# Altium schematic sheet Tenk.SchDoc: T90MProboj
size A3; Date: 2.2.2023; Author: Petar Ubavic; DrawnBy: Petar Ubavic; Engineer: Petar Ubavic; Organization: Ekipa 9; DocumentNumber: 1.1; SheetNumber: 1; SheetTotal: 1; CurrentTime: 15:06; CurrentDate: 2.2.2023; DocumentFullPathAndName: Tenk.SchDoc; DocumentName: Tenk; ProjectName: T90MProboj; Rule: PcbType=ProtelPcb; Rule: PcbType=ProtelPcb; Rule: PcbType=ProtelPcb
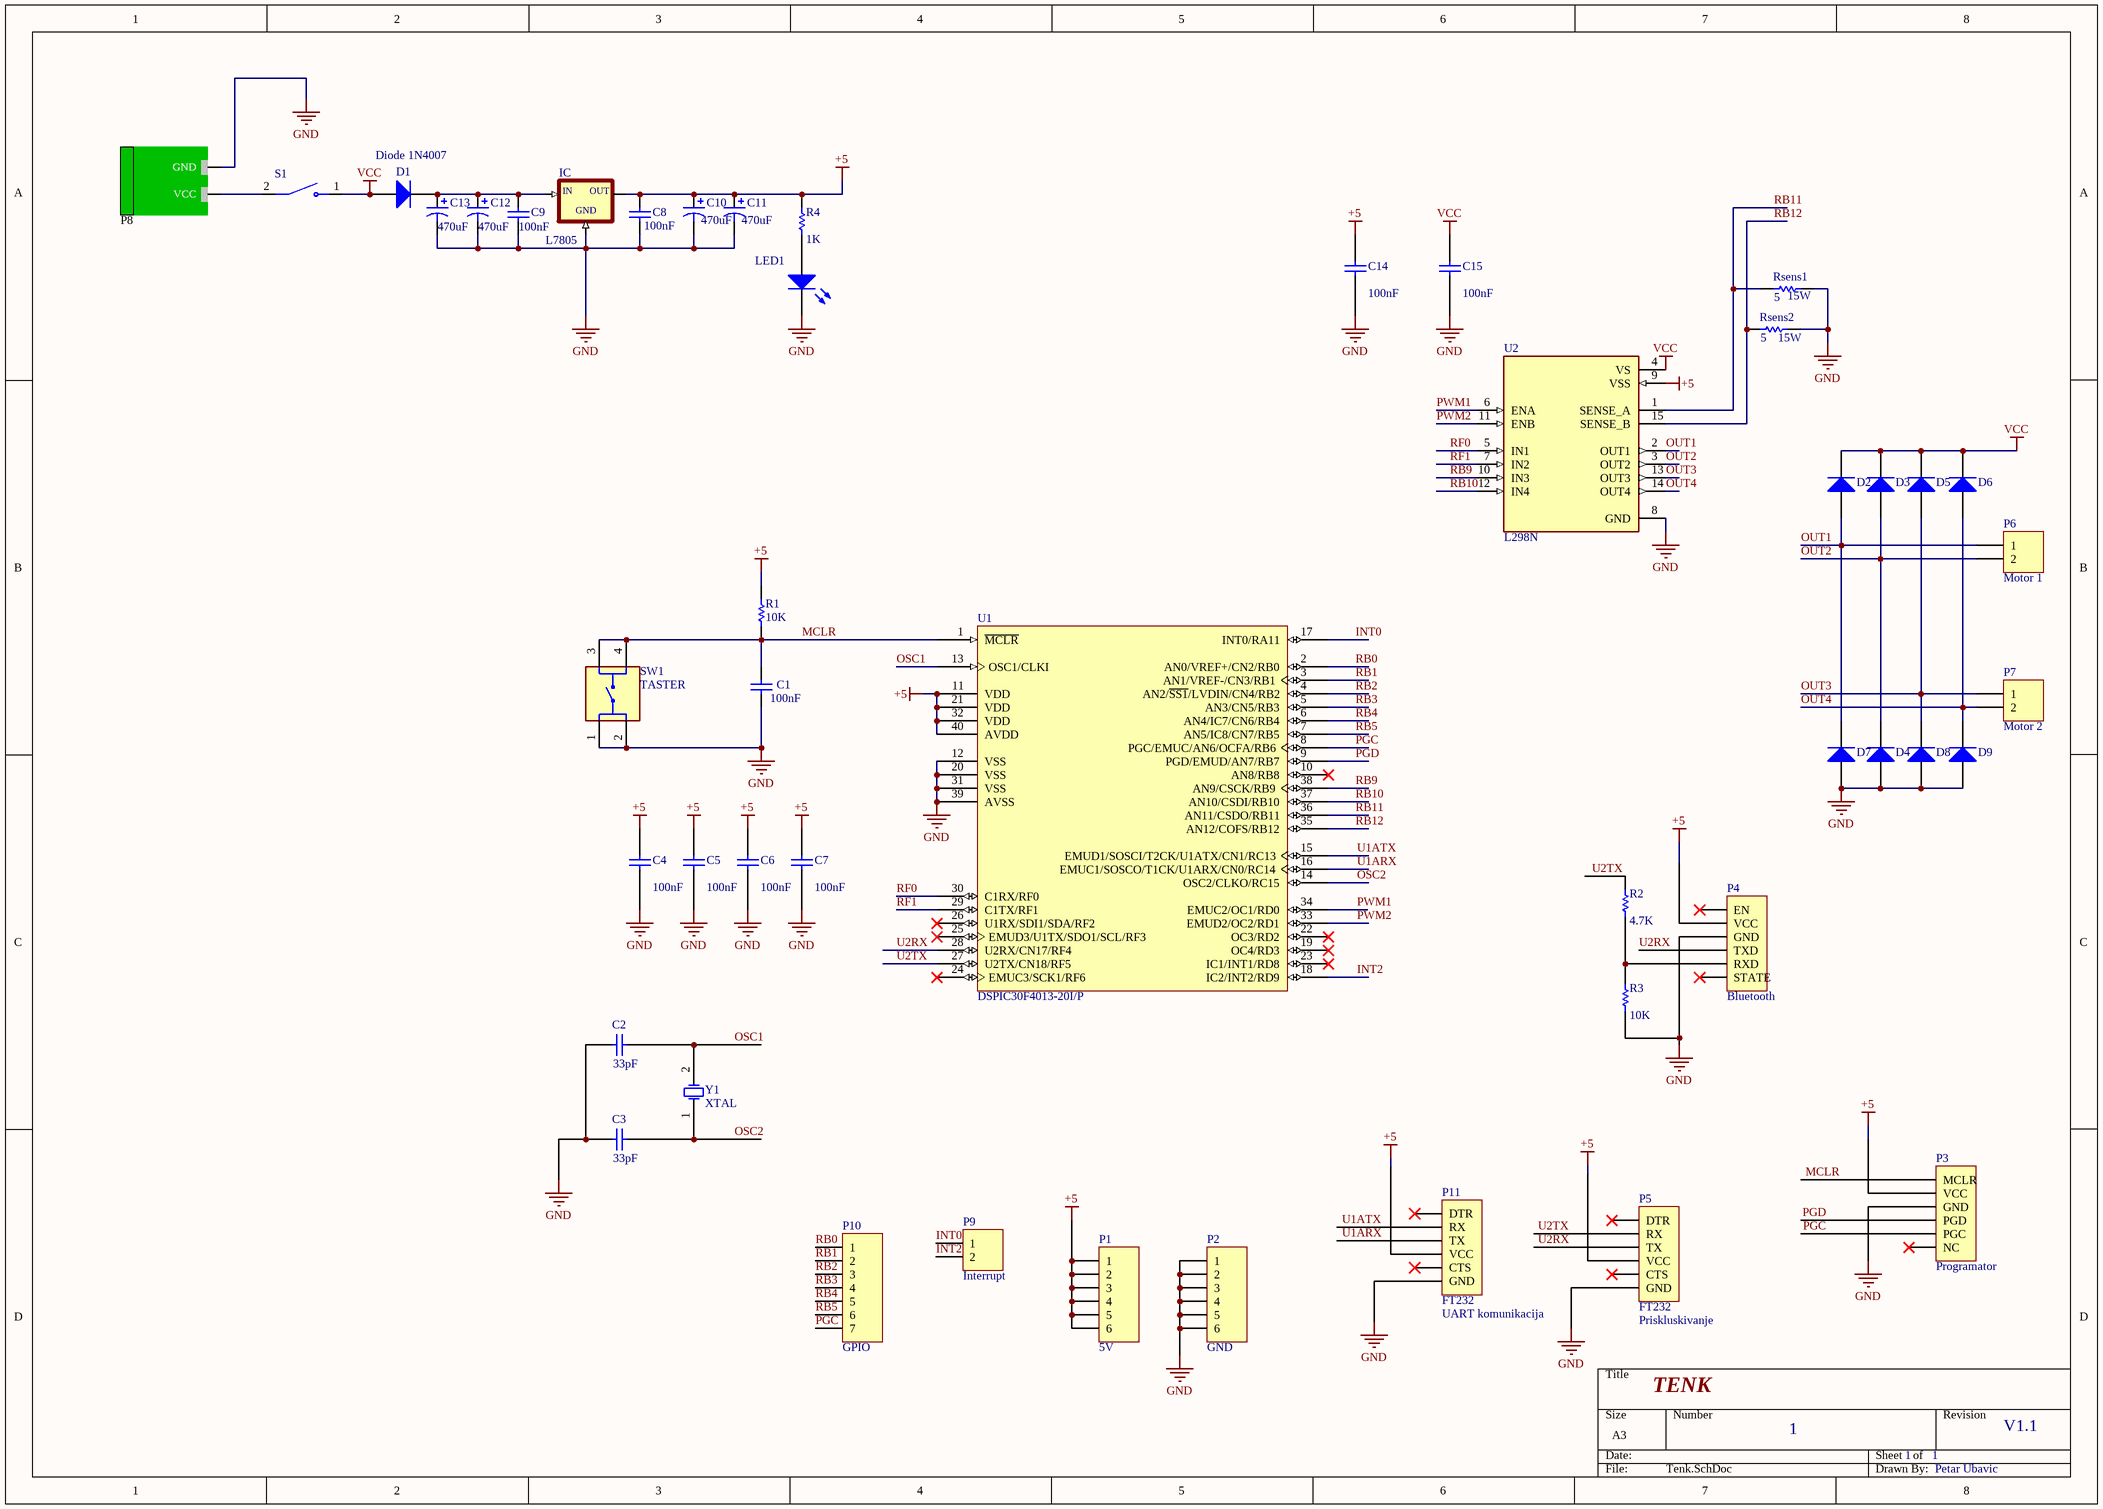
[diagram p0: Tenk.SchDoc]

## Parts
C1  value 100nF  [CAP200]  (hidden comment: Cap)
C2  value 33pF  [CAP200]  (hidden comment: Cap)
C3  value 33pF  [CAP200]  (hidden comment: Cap)
C4  value 100nF  [CAP200]  (hidden comment: Cap)
C5  value 100nF  [CAP200]  (hidden comment: Cap)
C6  value 100nF  [CAP200]  (hidden comment: Cap)
C7  value 100nF  [CAP200]  (hidden comment: Cap)
C8  value 100nF  [CAP200]  (hidden comment: Cap)
C9  value 100nF  [CAP200]  (hidden comment: Cap)
C10  value 470uF  [RAD4]  (hidden comment: Cap Pol1)
C11  value 470uF  [RAD4]  (hidden comment: Cap Pol1)
C12  value 470uF  [RAD4]  (hidden comment: Cap Pol1)
C13  value 470uF  [RAD4]  (hidden comment: Cap Pol1)
C14  value 100nF  [CAP200]  (hidden comment: Cap)
C15  value 100nF  [CAP200]  (hidden comment: Cap)
D1  Diode 1N4007  [DIODE400]
D2  Diode 1N5402  [DIODE400]  (value not drawn)
D3  Diode 1N5402  [DIODE400]  (value not drawn)
D4  Diode 1N5402  [DIODE400]  (value not drawn)
D5  Diode 1N5402  [DIODE400]  (value not drawn)
D6  Diode 1N5402  [DIODE400]  (value not drawn)
D7  Diode 1N5402  [DIODE400]  (value not drawn)
D8  Diode 1N5402  [DIODE400]  (value not drawn)
D9  Diode 1N5402  [DIODE400]  (value not drawn)
IC  L7805  [78XXS]
LED1  GREEN  [LED_2]  (value not drawn)
P1  5V  [HEADER_6]
P2  GND  [HEADER_6]
P3  Programator  [HEADER_6]
P4  Bluetooth  [HEADER_6]
P5  FT232  [HEADER_6]
P6  Motor 1  [HDR1X2]
P7  Motor 2  [HDR1X2]
P8  2EDGRC-5.08-02P-14-00A(H)  [PWR_Con]  (value not drawn)
P9  Interrupt  [HDR1X2]
P10  GPIO  [HDR1X7]
P11  FT232  [HEADER_6]
R1  value 10K  [RES400]  (hidden comment: Res1)
R2  value 4.7K  [RES400]  (hidden comment: Res1)
R3  value 10K  [RES400]  (hidden comment: Res1)
R4  value 1K  [RES400]  (hidden comment: Res1)
Rsens1  15W  value 5  [Rsens]
Rsens2  15W  value 5  [Rsens]
S1  (no value)  [SW_RB141C1100]
SW1  TASTER  [SW_1825910-6-4]
U1  DSPIC30F4013-20I/P  [PDIP600-P40]
U2  L298N  [TO127P2020X500X2100-15]
Y1  XTAL  [OSC_5]

## Nets
+5: C4.2 C5.2 C6.2 C7.2 C8.2 C10.1 C11.1 C14.2 IC.OUT P1.1 P1.2 P1.3 P1.4 P1.5 P1.6 P3.2(VCC) P4.2(VCC) P5.4(VCC) P11.4(VCC) R1.2 R4.2 U1.11(VDD) U1.21(VDD) U1.32(VDD) U1.40(AVDD) U2.9(VSS)
GND: C1.1 C2.1 C3.1 C4.1 C5.1 C6.1 C7.1 C8.1 C9.1 C10.2 C11.2 C12.2 C13.2 C14.1 C15.1 D4.1(A) D7.1(A) D8.1(A) D9.1(A) IC.GND LED1.2(K) P2.1 P2.2 P2.3 P2.4 P2.5 P2.6 P3.3(GND) P4.3(GND) P5.6(GND) P8.1(GND) P11.6(GND) R3.1 Rsens1.2 Rsens2.2 SW1.1 SW1.2 U1.12(VSS) U1.20(VSS) U1.31(VSS) U1.39(AVSS) U2.8(GND)
VCC: C15.2 D1.1(A) D2.2(K) D3.2(K) D5.2(K) D6.2(K) S1.1 U2.4(VS)
INT0: P9.1 U1.17(INT0/RA11)
INT2: P9.2 U1.18(IC2/INT2/RD9)
MCLR: C1.2 P3.1(MCLR) R1.1 SW1.3 SW1.4 U1.1(~{MCLR})
OSC1: C2.2 U1.13(OSC1/CLKI) Y1.2(OSC2)
OSC2: C3.2 U1.14(OSC2/CLKO/RC15) Y1.1(OSC1)
OUT1: D2.1(A) D7.2(K) P6.1 U2.2(OUT1)
OUT2: D3.1(A) D4.2(K) P6.2 U2.3(OUT2)
OUT3: D5.1(A) D8.2(K) P7.1 U2.13(OUT3)
OUT4: D6.1(A) D9.2(K) P7.2 U2.14(OUT4)
PGC: P3.5(PGC) P10.7 U1.8(PGC/EMUC/AN6/OCFA/RB6)
PGD: P3.4(PGD) U1.9(PGD/EMUD/AN7/RB7)
PWM1: U1.34(EMUC2/OC1/RD0) U2.6(ENA)
PWM2: U1.33(EMUD2/OC2/RD1) U2.11(ENB)
RB0: P10.1 U1.2(AN0/VREF+/CN2/RB0)
RB1: P10.2 U1.3(AN1/VREF-/CN3/RB1)
RB2: P10.3 U1.4(AN2/~{SS1}/LVDIN/CN4/RB2)
RB3: P10.4 U1.5(AN3/CN5/RB3)
RB4: P10.5 U1.6(AN4/IC7/CN6/RB4)
RB5: P10.6 U1.7(AN5/IC8/CN7/RB5)
RB9: U1.38(AN9/CSCK/RB9) U2.10(IN3)
RB10: U1.37(AN10/CSDI/RB10) U2.12(IN4)
RB11: Rsens1.1 U1.36(AN11/CSDO/RB11) U2.1(SENSE_A)
RB12: Rsens2.1 U1.35(AN12/COFS/RB12) U2.15(SENSE_B)
RF0: U1.30(C1RX/RF0) U2.5(IN1)
RF1: U1.29(C1TX/RF1) U2.7(IN2)
U1ARX: P11.3(TX) U1.16(EMUC1/SOSCO/T1CK/U1ARX/CN0/RC14)
U1ATX: P11.2(RX) U1.15(EMUD1/SOSCI/T2CK/U1ATX/CN1/RC13)
U2RX: P4.4(TXD) P5.3(TX) U1.28(U2RX/CN17/RF4)
U2TX: P5.2(RX) R2.2 U1.27(U2TX/CN18/RF5)
NetC9_2: C9.2 C12.1 C13.1 D1.2(K) IC.IN
NetLED1_1: LED1.1(A) R4.1
NetP4_5: P4.5(RXD) R2.1 R3.2
NetP8_2: P8.2(VCC) S1.2

Not connected (* = marked no-connect by the designer): P3 6(NC)*; P4 1(EN)* 6(STATE)*; P5 1(DTR)* 5(CTS)*; P11 1(DTR)* 5(CTS)*; U1 10(AN8/RB8)* 19(OC4/RD3)* 22(OC3/RD2)* 23(IC1/INT1/RD8)* 24(EMUC3/SCK1/RF6)* 25(EMUD3/U1TX/SDO1/SCL/RF3)* 26(U1RX/SDI1/SDA/RF2)*

## Notes on the sheet
- (near P11) UART komunikacija
- (near P5) Priskluskivanje
- TENK
- 1
- V1.1
- Petar Ubavic

## Library data of the parts
C1-C9 C14 C15 = Cap: Capacitor; Published: 8-Jun-2000; LatestRevisionDate: 17-Jul-2002; LatestRevisionNote: Re-released for DXP Platform.; PackageReference: RAD-0.3; Publisher: Altium Limited; PackageDescription: Radial Cap, Thru-Hole; 2 Leads; 0.3 in Pin Spacing
C10-C13 = Cap Pol1: Polarized Capacitor (Radial); Published: 8-Jun-2000; LatestRevisionDate: 17-Jul-2002; LatestRevisionNote: Re-released for DXP Platform.; PackageReference: RB7.6-15; Publisher: Altium Limited; PackageDescription: Polarized Capacitor (Radial); 2 Leads
D1 = Diode 1N4007: 1 Amp General Purpose Rectifier; Published: 8-Jun-2000; LatestRevisionDate: 17-Jul-2002; LatestRevisionNote: Re-released for DXP Platform.; DatasheetVersion: 1998; PackageVersion: Aug-1999; PackageReference: DO-41; Publisher: Altium Limited; PackageDescription: Diode, Axial; Body 5.2 x 2.7 mm (LxDia. max), Lead Dia. 0.86 mm (max); Code_JEDEC: DO-204-AL; ComponentLink1Description: Manufacturer Link; ComponentLink1URL: http://www.fairchildsemi.com/; ComponentLink2Description: Datasheet; ComponentLink2URL: http://www.fairchildsemi.com/ds/1N%2F1N4001.pdf
D2-D9 = Diode 1N5402: 3 Amp General Purpose Rectifier; Published: 8-Jun-2000; LatestRevisionDate: 17-Jul-2002; LatestRevisionNote: Re-released for DXP Platform.; DatasheetVersion: 1998; PackageVersion: Aug-1999; PackageReference: DO-201AD; Publisher: Altium Limited; PackageDescription: Diode, Axial; Body 9.5 x 5.6 mm (LxDia. max), Lead Dia. 1.32 mm (max); ComponentLink1Description: Manufacturer Link; ComponentLink1URL: http://www.fairchildsemi.com/; ComponentLink2Description: Datasheet; ComponentLink2URL: http://www.fairchildsemi.com/ds/1N%2F1N5400.pdf
IC = L7805: Linear Voltage Regulator IC 1 Output 1.5A D2PAK; MF: STMicroelectronics; Package: TO-263-3 Inchange Semiconductor; Availability: Unavailable; MP: L7805; Value: *; SnapEDA_Link: https://www.snapeda.com/parts/L7805/STMicroelectronics/view-part/563125/?ref=snap; Price: None
LED1 = LED1: Typical RED GaAs LED; Published: 8-Jun-2000; LatestRevisionDate: 08-Jul-2005; LatestRevisionNote: Mech Layer 1 removed.; PackageReference: LED-1; Publisher: Altium Limited; PackageDescription: LED; 2 Leads
P1-P5 P11 = Header 6: Header, 6-Pin; LatestRevisionDate: 17-Jul-2002; LatestRevisionNote: Re-released for DXP Platform.; Publisher: Altium Limited
P6 P7 P9 = Header 2: Header, 2-Pin; LatestRevisionDate: 17-Jul-2002; LatestRevisionNote: Re-released for DXP Platform.; Publisher: Altium Limited
P8 = 00000002: TERM BLOCK HDR 2POS 90DEG 5.08MM; Suplier: TME; Manufacturer Part Number: 2EDGRC-5.08-02P-14-00A(H); Suplier Product Link: https://www.tme.eu/en/details/2edgrc5.08-2p14/pluggable-terminal-blocks/degson-electronics/2edgrc-508-02p-14-00ah/; Price: 0.1304
P10 = Header 7: Header, 7-Pin; LatestRevisionDate: 17-Jul-2002; LatestRevisionNote: Re-released for DXP Platform.; Publisher: Altium Limited
R1-R4 Rsens1 Rsens2 = Res1: Resistor; Published: 8-Jun-2000; LatestRevisionDate: 17-Jul-2002; LatestRevisionNote: Re-released for DXP Platform.; Publisher: Altium Limited
  R1-R4: PackageReference: AXIAL-0.3; PackageDescription: Axial Device, Thru-Hole; 2 Leads; 0.3 in Pin Spacing
  Rsens1 Rsens2: PackageDescription: Axial Device, Thru-Hole; 2 Leads;
S1 = RB141C1100: Rocker Switches 15A 125VAC, OFF-ON, Black Rocker, No Markings; MF: e-switch inc; Value: *; SnapEDA_Link: https://www.snapeda.com/parts/RB141C1100/ITC/view-part/?ref=snap; MP: RB141C1100; Purchase-URL: https://pricing.snapeda.com/search/part/RB141C1100/?ref=eda; Check_prices: https://www.snapeda.com/parts/RB141C1100/ITC/view-part/?ref=eda; Availability: In Stock; Price: None; Package: None
SW1 = 1825910-6: Switch Tactile OFF (ON) SPST Round Button PC Pins 0.05A 24VDC 100000Cycles 1.57N Thru-Hole Loose; Price: None; MP: 1825910-6; Availability: Unavailable; Value: *; Package: None
U1 = DSPIC30F4013-20I/P: High-Performance 16-bit Digital Signal Controller, 48 KB Flash, 2 KB SRAM, 1 KB EEPROM, 40-Pin PDIP, Industrial Temperature; Published: 29-Jan-2009; DatasheetVersion: revF, Apr-2008; PackageVersion: revBB, Aug-2009; PackageReference: PDIP600-P40; Publisher: Altium Limited; PackageDescription: 40-Lead Plastic Dual In-Line (P) - 600 mil Body [PDIP]; Supplier 1: Digi-Key; Supplier Part Number 1: DSPIC30F4013-20IP-ND; Supplier 2: Farnell; Supplier Part Number 2: 1439755; ComponentLink1Description: Datasheet; ComponentLink1URL: http://ww1.microchip.com/downloads/en/DeviceDoc/70138F.pdf; ComponentLink2Description: Packaging Specification; ComponentLink2URL: http://www.microchip.com/stellent/groups/techpub_sg/documents/packagingspec/en012702.pdf; ComponentLink3Description: Microchip.com Home; ComponentLink3URL: http://www.microchip.com/
U2 = L298N: Dual Full Bridge Motor Driver 15-Pin(15+Tab) MULTIWATT V Tube; MP: L298N; Availability: Unavailable; Package: None; Value: *; Price: None
Y1 = XTAL: Crystal Oscillator; Published: 8-Jun-2000; LatestRevisionDate: 17-Jul-2002; LatestRevisionNote: Re-released for DXP Platform.; PackageReference: R38; Publisher: Altium Limited; PackageDescription: Crystal, Thru-Hole; 2 Leads; Body 3.1 x 8.2 mm (Dia.xH)